# Altium schematic sheet FE_Channel.SchDoc
size A4
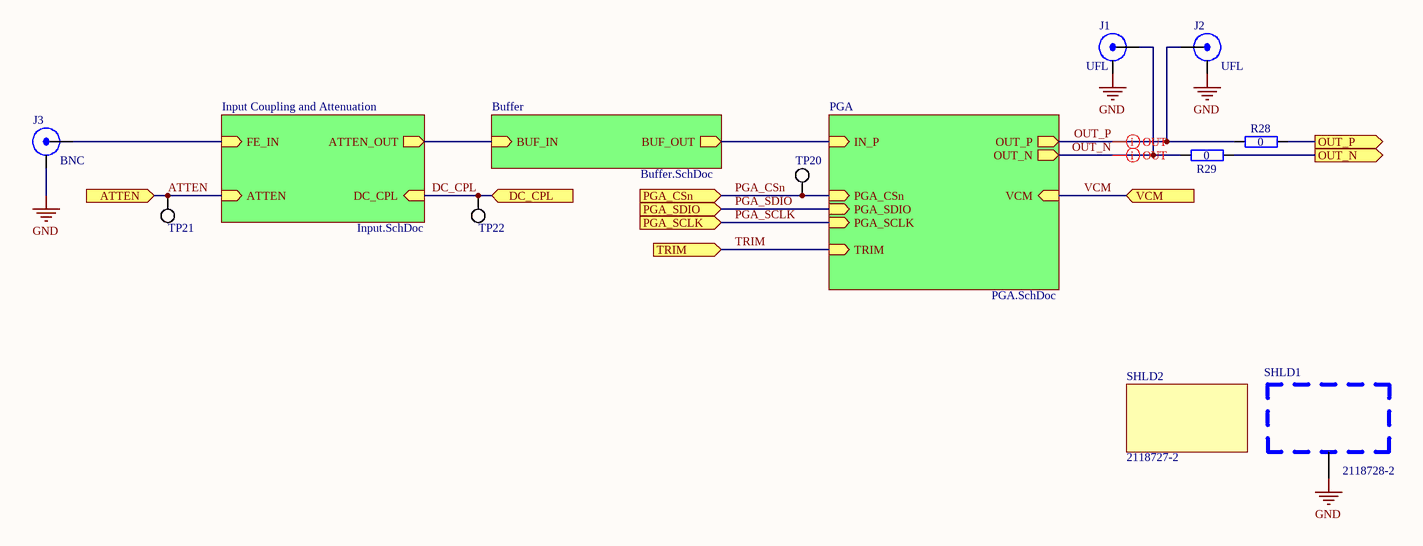
[diagram p0: FE_Channel.SchDoc]

## Parts
J1  UFL  [TE_2334884-1]
J2  UFL  [TE_2334884-1]
J3  BNC  [MOL_0731000105]
R28  0  [GEN_R_0402]
R29  0  [GEN_R_0402]
SHLD1  2118728-2  [TE_2118728-2]
SHLD2  2118727-2  (mechanical)
TP20  PCB  [GEN_TP_PCB]  (value not drawn)  (no BOM)
TP21  PCB  [GEN_TP_PCB]  (value not drawn)  (no BOM)
TP22  PCB  [GEN_TP_PCB]  (value not drawn)  (no BOM)

## Sub-sheets
Buffer = Buffer.SchDoc: BUF_IN (in), BUF_OUT (out)
Input Coupling and Attenuation = Input.SchDoc: ATTEN (in), FE_IN (in), ATTEN_OUT (out), DC_CPL (in)
PGA = PGA.SchDoc: IN_P (in), OUT_N (out), PGA_SDIO (in), OUT_P (out), VCM (in), PGA_SCLK (in), PGA_CSn (in), TRIM (in)

## Ports
ATTEN (in), DC_CPL (in), OUT_N (out), OUT_P (out), PGA_CSn (in), PGA_SCLK (in), PGA_SDIO (in), TRIM (in), VCM (in)

## Nets
GND: J1.2(SHIELD) J2.2(SHIELD) J3.2(SHIELD) SHLD1.1
ATTEN: TP21.1 ; port ATTEN, sheet Input Coupling and Attenuation/ATTEN
DC_CPL: TP22.1 ; port DC_CPL, sheet Input Coupling and Attenuation/DC_CPL
OUT_N: R29.2 ; port OUT_N
OUT_N: J1.1(Signal) R29.1 ; sheet PGA/OUT_N  [a separate net that carries the same name]
OUT_P: R28.2 ; port OUT_P
OUT_P: J2.1(Signal) R28.1 ; sheet PGA/OUT_P  [a separate net that carries the same name]
PGA_CSn: TP20.1 ; port PGA_CSn, sheet PGA/PGA_CSn
PGA_SCLK: port PGA_SCLK, sheet PGA/PGA_SCLK
PGA_SDIO: port PGA_SDIO, sheet PGA/PGA_SDIO
TRIM: port TRIM, sheet PGA/TRIM
VCM: port VCM, sheet PGA/VCM
NetJ3_1: J3.1(Signal) ; sheet Input Coupling and Attenuation/FE_IN
(unnamed): sheet Input Coupling and Attenuation/ATTEN_OUT, sheet Buffer/BUF_IN
(unnamed): sheet Buffer/BUF_OUT, sheet PGA/IN_P

## Layout directives
differential pair: OUT_N, OUT_P

## Library data of the parts
J1 J2 = UFL Jack SMD: Supplier 1: Digi-Key; Supplier Part Number 1: A145155CT-ND
J3 = BNC JACK R/A: Supplier 1: Digi-Key; Supplier Part Number 1: WM5524-ND
R28 R29 = RES 0 OHM 1/16W 0402: Power Rating: 0.0625W; Package: 0402; Supplier 1: Digi-Key; Supplier Part Number 1: 311-0.0JRCT-ND; Value: 0
SHLD1 = SHIELD 2118728-2: Supplier 1: Digi-Key; Supplier Part Number 1: A126158CT-ND
SHLD2 = SHIELD 2118727-2: Supplier 1: Digi-Key; Supplier Part Number 1: A126132-ND
TP20-TP22 = TP PCB 1mm